# Altium project ADS1118_board.PrjPcb
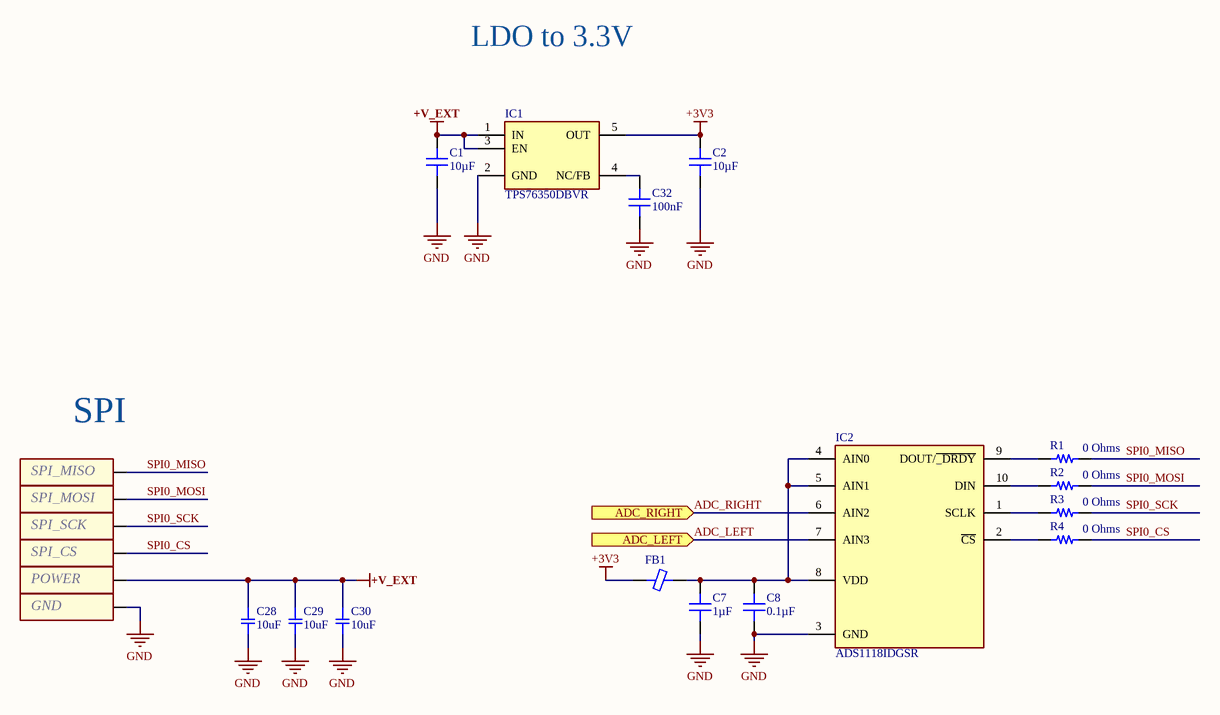
[diagram p0: ADC.SchDoc]
2 sheets, 56 parts. Net scope: flat (ports and power ports of the same name join across sheets).
Board file: ADS1118_board.PcbDoc
Sheets:
  ADC.SchDoc
  Analog.SchDoc

## Sheet ADC.SchDoc
size A4

### Parts
C1  10µF  [CAP 0603_1608]
C2  10µF  [CAP 0603_1608]
C7  1µF  [CAP 0603_1608]
C8  0.1µF  [CAP 0603_1608]
C28  10uF  [SMD-0805C]
C29  10uF  [SMD-0805C]
C30  10uF  [SMD-0805C]
C32  100nF  [CAP 0603_1608]
FB1  (no value)  [FER 0603_1608]
IC1  TPS76350DBVR  [SOT95P280X145-5N]
IC2  ADS1118IDGSR  [SOP50P490X110-10N]
R1  0 Ohms  [RES 0603_1608]
R2  0 Ohms  [RES 0603_1608]
R3  0 Ohms  [RES 0603_1608]
R4  0 Ohms  [RES 0603_1608]
X1  SPI_MISO  [PLS-1]  (no BOM)
X2  Name: SPI_MOSI  [PLS-1]  (hidden comment: SPI_MISO)  (no BOM)
X3  Name: SPI_SCK  [PLS-1]  (hidden comment: SPI_MISO)  (no BOM)
X4  Name: SPI_CS  [PLS-1]  (hidden comment: SPI_MISO)  (no BOM)
X5  Name: POWER  [PLS-1]  (hidden comment: SPI_MISO)  (no BOM)
X6  Name: GND  [PLS-1]  (hidden comment: SPI_MISO)  (no BOM)

### Ports
ADC_LEFT (in), ADC_RIGHT (in)

### Nets
+3V3: C2.2 FB1.1 IC1.5(OUT)
+V_EXT: C1.2 C28.1 C29.1 C30.1 IC1.1(IN) IC1.3(EN) X5.1
GND: C1.1 C2.1 C7.1 C8.1 C28.2 C29.2 C30.2 C32.1 IC1.2(GND) IC2.3(GND) X6.1
ADC_LEFT: IC2.7(AIN3) ; port ADC_LEFT
ADC_RIGHT: IC2.6(AIN2) ; port ADC_RIGHT
SPI0_CS: R4.1 X4.1
SPI0_MISO: R1.1 X1.1
SPI0_MOSI: R2.1 X2.1
SPI0_SCK: R3.1 X3.1
NetC7_2: C7.2 C8.2 FB1.2 IC2.4(AIN0) IC2.5(AIN1) IC2.8(VDD)
NetC32_2: C32.2 IC1.4(NC/FB)
NetIC2_1: IC2.1(SCLK) R3.2
NetIC2_2: IC2.2(~{CS}) R4.2
NetIC2_9: IC2.9(DOUT/~{_DRDY}) R1.2
NetIC2_10: IC2.10(DIN) R2.2

### Notes on the sheet
- LDO to 3.3V
- (near X1) SPI
- Title
- Size:
- Date:
- A4
- Number:
- Time:
- Revision:
- Sheet
- of
- File:

### Library data of the parts
C1 C2 C7 C8 C32 = 100X14W104MV4T: CAP CER 0.1UF 10V X7R 0603; Part Number: 100X14W104MV4T
  C1 C2: Value: 10µF
  C7: Value: 1µF
  C8: Value: 0.1µF
  C32: Value: 100nF
C28-C30 = GRJ21BR71A106KE01L: CAP CER 10UF 10V X7R 0805; Manufacturer: Murata Electronics North America; Factory Stock: 0; Unit Price (USD): 0,69; Minimum Quantity: 1; Tolerance: ±10%; Part Number: GRJ21BR71A106KE01L; Datasheets: http://www.murata.com/~/media/webrenewal/support/library/catalog/products/capacitor/mlcc/c02e.pdf; Image: //media.digikey.com/Renders/Murata%20Renders/0805%20(2012%20Metric)%20.85mm.jpg; Digi-Key Part Number: 490-10919-1-ND; Quantity Available: 6658; @ qty: 0; Packaging: Cut Tape (CT); Series: GRJ; Part Status: Active; Value: 10uF; Voltage: 10V; Temperature Coefficient: X7R; Operating Temperature: -55°C ~ 125°C; Features: Soft Termination; Ratings: -; Applications: Boardflex Sensitive; Mounting Type: Surface Mount, MLCC; Package / Case: 0805 (2012 Metric); Size / Dimension: 0.079" L x 0.049" W (2.00mm x 1.25mm); Height - Seated (Max): -; Thickness (Max): 0.057" (1.45mm); Lead Spacing: -; Lead Style: -
FB1 = 2506031217H0: FERRITE BEAD 0603 1LN; Part Number: 2506031217H0
IC1 = TPS76350DBVR: Integrated Circuit; Manufacturer_Name: Texas Instruments; Datasheet Link: https://www.ti.com/lit/gpn/TPS763; Height: 1.45mm; Manufacturer_Part_Number: TPS76350DBVR; Mouser Part Number: 595-TPS76350DBVR; Mouser Price/Stock: https://www.mouser.co.uk/ProductDetail/Texas-Instruments/TPS76350DBVR?qs=8yeEWhuAOtMYKUfRRdAKSw%3D%3D; Arrow Part Number: TPS76350DBVR; Arrow Price/Stock: https://www.arrow.com/en/products/tps76350dbvr/texas-instruments
IC2 = ADS1118IDGSR: Integrated Circuit; Manufacturer_Name: Texas Instruments; Datasheet Link: http://www.ti.com/lit/gpn/ads1118; Height: 1.1mm; Manufacturer_Part_Number: ADS1118IDGSR; Mouser Part Number: 595-ADS1118IDGSR; Mouser Price/Stock: https://www.mouser.co.uk/ProductDetail/Texas-Instruments/ADS1118IDGSR?qs=g5raLcSarOb4n6jVZI8bUw%3D%3D; Arrow Part Number: ADS1118IDGSR; Arrow Price/Stock: https://www.arrow.com/en/products/ads1118idgsr/texas-instruments?region=nac
R1-R4 = RNCS0603BKE100R: RES 100 OHM 0.1% 1/16W 0603; Part Number: RNCS0603BKE100R; Value: 0 Ohms
X1-X6 = IN-OUT pin: Manufacturer: KHADB; ID: IN-OUT pin
  X1: Name: SPI_MISO

## Sheet Analog.SchDoc
size A3
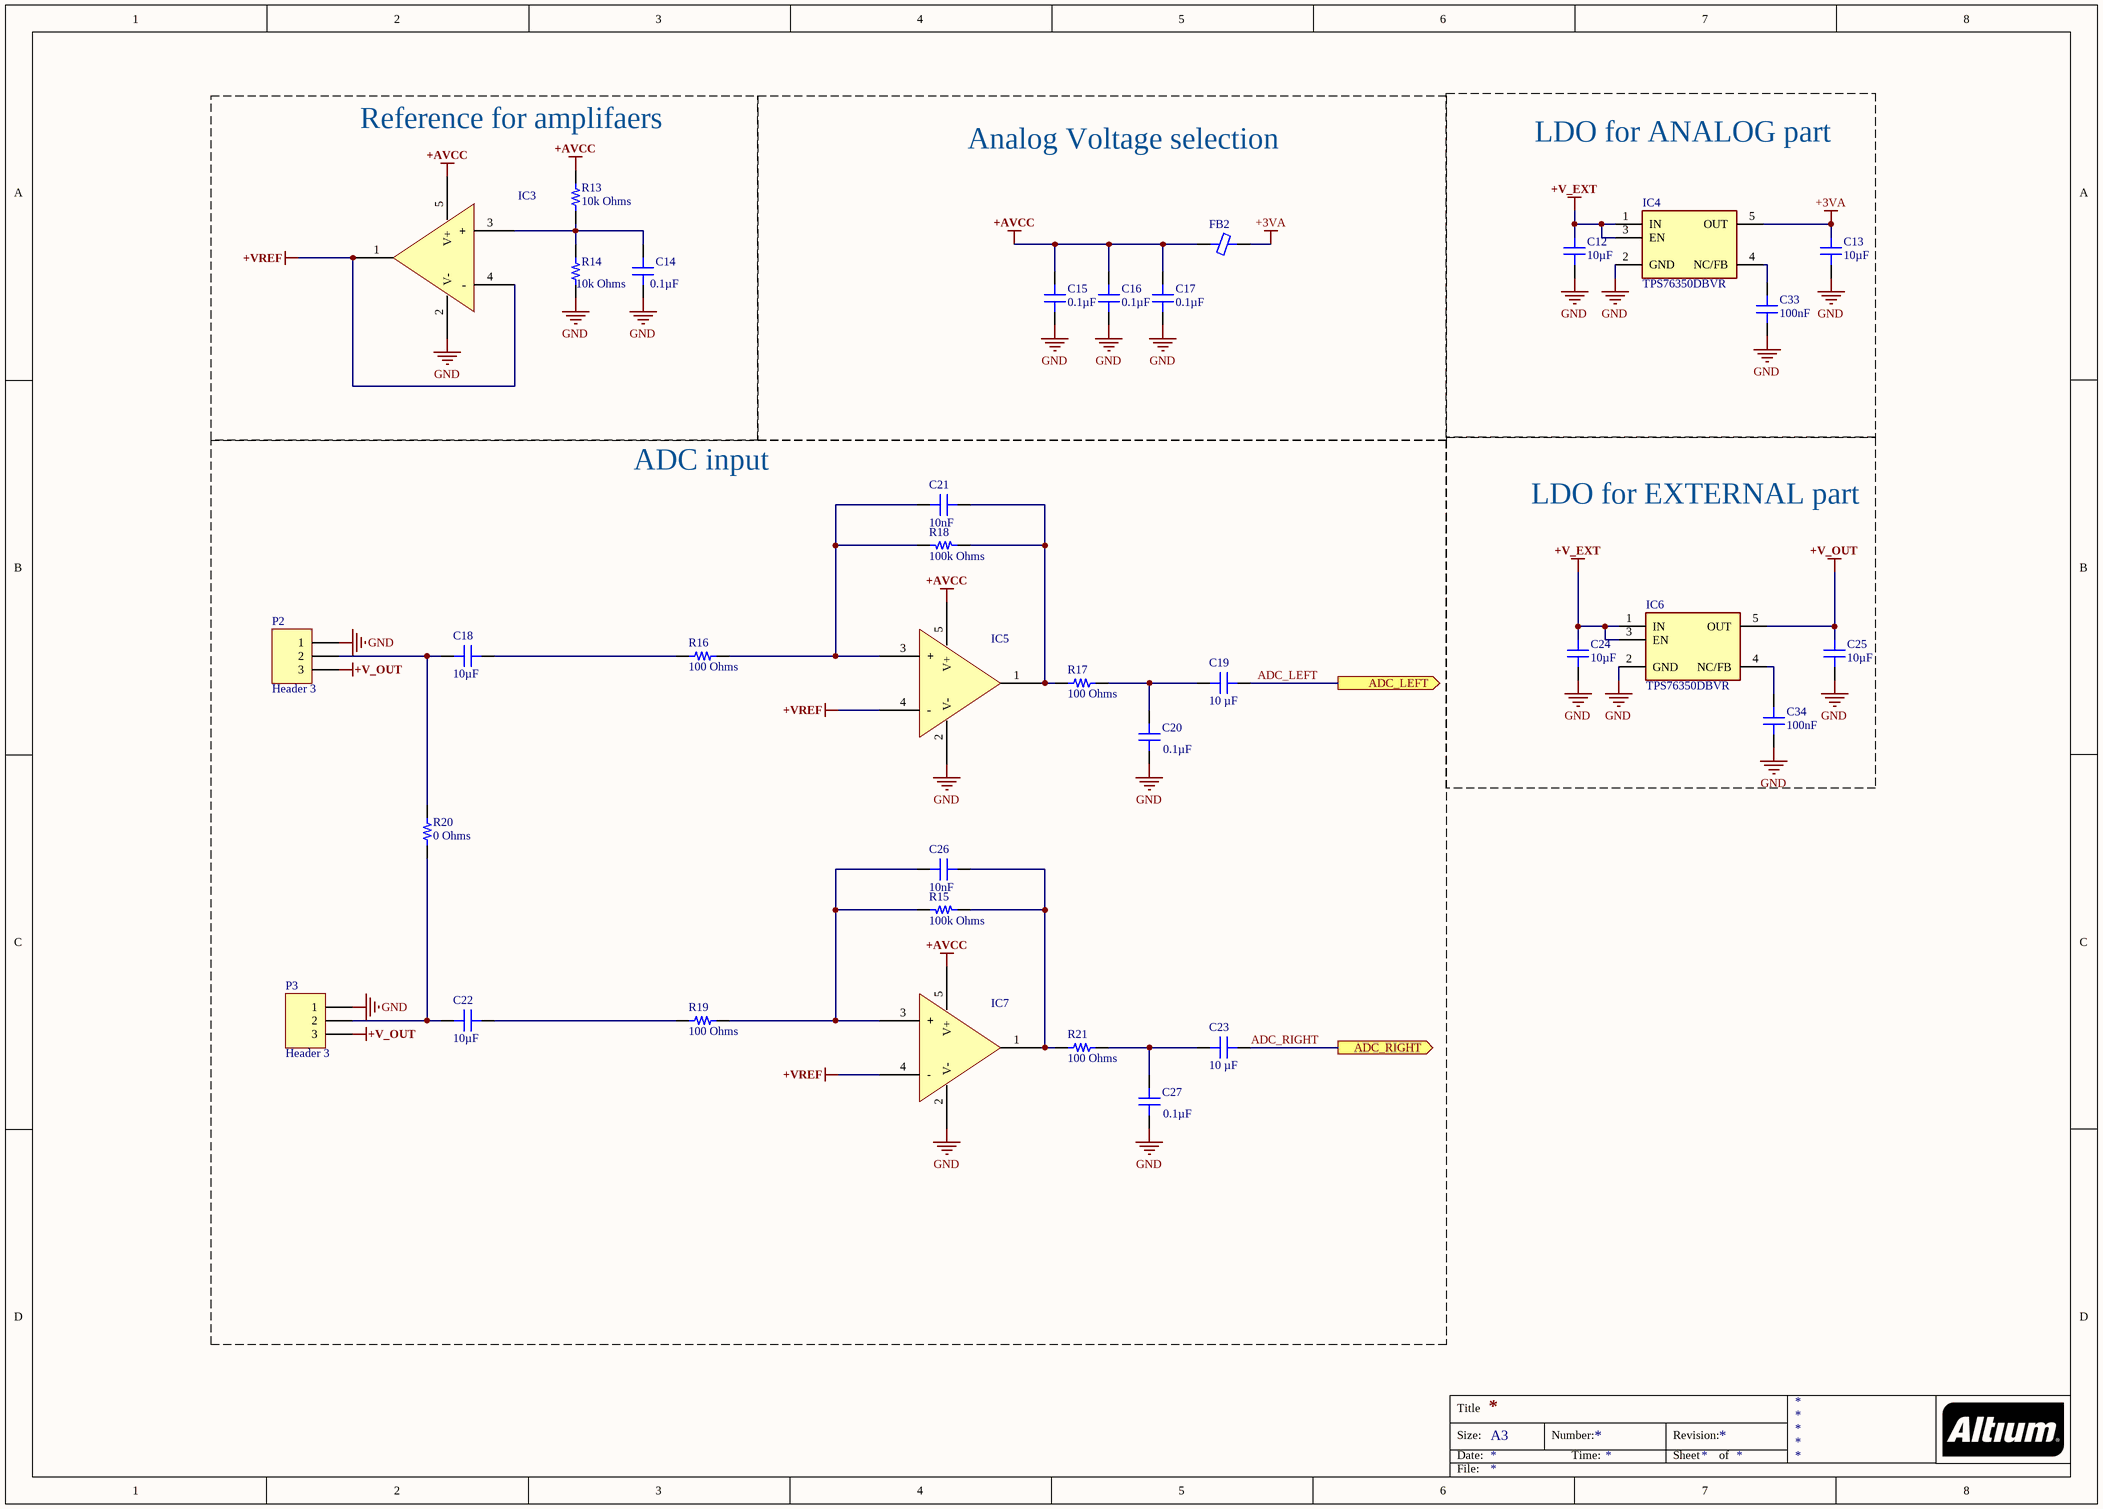
[diagram p1: Analog.SchDoc]

### Parts
C12  10µF  [CAP 0603_1608]
C13  10µF  [CAP 0603_1608]
C14  0.1µF  [CAP 0603_1608]
C15  0.1µF  [CAP 0603_1608]
C16  0.1µF  [CAP 0603_1608]
C17  0.1µF  [CAP 0603_1608]
C18  10µF  [CAP 0603_1608]
C19  10 µF  [CAP 0603_1608]
C20  0.1µF  [CAP 0603_1608]
C21  10nF  [CAP 0603_1608]
C22  10µF  [CAP 0603_1608]
C23  10 µF  [CAP 0603_1608]
C24  10µF  [CAP 0603_1608]
C25  10µF  [CAP 0603_1608]
C26  10nF  [CAP 0603_1608]
C27  0.1µF  [CAP 0603_1608]
C33  100nF  [CAP 0603_1608]
C34  100nF  [CAP 0603_1608]
FB2  (no value)  [FER 0603_1608]
IC3  AD8541ARTZ-REEL7  [ANALOG SOT-23-5 RJ-5]  (value not drawn)
IC4  TPS76350DBVR  [SOT95P280X145-5N]
IC5  AD8541ARTZ-REEL7  [ANALOG SOT-23-5 RJ-5]  (value not drawn)
IC6  TPS76350DBVR  [SOT95P280X145-5N]
IC7  AD8541ARTZ-REEL7  [ANALOG SOT-23-5 RJ-5]  (value not drawn)
P2  Header 3  [HDR1X3]
P3  Header 3  [HDR1X3]
R13  10k Ohms  [RES 0603_1608]
R14  10k Ohms  [RES 0603_1608]
R15  100k Ohms  [RES 0603_1608]
R16  100 Ohms  [RES 0603_1608]
R17  100 Ohms  [RES 0603_1608]
R18  100k Ohms  [RES 0603_1608]
R19  100 Ohms  [RES 0603_1608]
R20  0 Ohms  [RES 0603_1608]
R21  100 Ohms  [RES 0603_1608]

### Ports
ADC_LEFT (out), ADC_RIGHT (out)

### Nets
+3VA: C13.2 FB2.2 IC4.5(OUT)
+AVCC: C15.2 C16.2 C17.2 FB2.1 IC3.5(V+) IC5.5(V+) IC7.5(V+) R13.2
+V_EXT: C12.2 C24.2 IC4.1(IN) IC4.3(EN) IC6.1(IN) IC6.3(EN)
+V_OUT: C25.2 IC6.5(OUT) P2.3 P3.3
+VREF: IC3.1(OUT) IC3.4(-) IC5.4(-) IC7.4(-)
GND: C12.1 C13.1 C14.1 C15.1 C16.1 C17.1 C20.1 C24.1 C25.1 C27.1 C33.1 C34.1 IC3.2(V-) IC4.2(GND) IC5.2(V-) IC6.2(GND) IC7.2(V-) P2.1 P3.1 R14.1
ADC_LEFT: C19.2 ; port ADC_LEFT
ADC_RIGHT: C23.2 ; port ADC_RIGHT
NetC14_2: C14.2 IC3.3(+) R13.1 R14.2
NetC18_1: C18.1 R16.2
NetC18_2: C18.2 P2.2 R20.1
NetC19_1: C19.1 C20.2 R17.1
NetC21_1: C21.1 IC5.1(OUT) R17.2 R18.1
NetC21_2: C21.2 IC5.3(+) R16.1 R18.2
NetC22_1: C22.1 R19.2
NetC22_2: C22.2 P3.2 R20.2
NetC23_1: C23.1 C27.2 R21.1
NetC26_1: C26.1 IC7.1(OUT) R15.1 R21.2
NetC26_2: C26.2 IC7.3(+) R15.2 R19.1
NetC33_2: C33.2 IC4.4(NC/FB)
NetC34_2: C34.2 IC6.4(NC/FB)

### Notes on the sheet
- (near R13) Reference for amplifaers
- Analog Voltage selection
- LDO for ANALOG part
- ADC input
- LDO for EXTERNAL part
- Title
- Size:
- Date:
- A3
- Number:
- Time:
- Revision:
- Sheet
- of
- File:

### Library data of the parts
C12-C27 C33 C34 = 100X14W104MV4T: CAP CER 0.1UF 10V X7R 0603; Part Number: 100X14W104MV4T
  C12 C13 C18 C22 C24 C25: Value: 10µF
  C14-C17 C20 C27: Value: 0.1µF
  C19 C23: Value: 10 µF
  C21 C26: Value: 10nF
  C33 C34: Value: 100nF
FB2 = 2506031217H0: FERRITE BEAD 0603 1LN; Part Number: 2506031217H0
IC3 IC5 IC7 = AD8541ARTZ-REEL7: IC OPAMP GP 1 CIRCUIT SOT23-5; Manufacturer: Analog Devices Inc.; Amplifier Type: General Purpose; Current - Input Bias: 4pA; Current - Output / Channel: 30mA; Current - Supply: 45µA; Gain Bandwidth Product: 1MHz; Number of Circuits: 1; Output Type: Rail-to-Rail; Slew Rate: 0.92V/µs; Voltage - Input Offset: 1mV; Voltage - Supply, Single/Dual (±): 2.7V ~ 5.5V; Part Number: AD8541ARTZ-REEL7; ComponentLink1Description: Datasheet; ComponentLink1URL: https://www.analog.com/media/en/technical-documentation/data-sheets/AD8541_8542_8544.pdf; ComponentLink2Description: DigiKey Link; ComponentLink2URL: http://digikey.com/product-detail/en/analog-devices-inc/AD8541ARTZ-REEL7/AD8541ARTZ-REEL7CT-ND/813416; Device Package: SC-74A, SOT-753; LastUpdated: 08.01.2020 23:39:15; Lifecycle Status: Active; Minimum Order: 1; Mounting Type: Surface Mount; Operating Temperature: -40°C ~ 125°C; Package / Case: SC-74A, SOT-753; Packaging: ReReel; PartId: 9; Part Status: Active; Price: 0.00; Series: -; Supplier 1: DigiKey; Supplier Part Number 1: AD8541ARTZ-REEL7CT-ND; Supplier Device Package: SOT-23-5
IC4 IC6 = TPS76350DBVR: as IC1 on sheet ADC; Datasheet Link: https://www.ti.com/lit/gpn/TPS763; Height: 1.45mm; Manufacturer_Part_Number: TPS76350DBVR; Mouser Part Number: 595-TPS76350DBVR; Mouser Price/Stock: https://www.mouser.co.uk/ProductDetail/Texas-Instruments/TPS76350DBVR?qs=8yeEWhuAOtMYKUfRRdAKSw%3D%3D; Arrow Part Number: TPS76350DBVR; Arrow Price/Stock: https://www.arrow.com/en/products/tps76350dbvr/texas-instruments
P2 P3 = Header 3: Header, 3-Pin; LatestRevisionDate: 17-Jul-2002; LatestRevisionNote: Re-released for DXP Platform.; Publisher: Altium Limited
R13-R21 = RNCS0603BKE100R: RES 100 OHM 0.1% 1/16W 0603; Part Number: RNCS0603BKE100R
  R13 R14: Value: 10k Ohms
  R15 R18: Value: 100k Ohms
  R16 R17 R19 R21: Value: 100 Ohms
  R20: Value: 0 Ohms

## Nets that join several sheets
+V_EXT: ADC (7 pins), Analog (6 pins)
GND: ADC (11 pins), Analog (20 pins)
ADC_LEFT: ADC (IC2.7), Analog (C19.2)
ADC_RIGHT: ADC (IC2.6), Analog (C23.2)